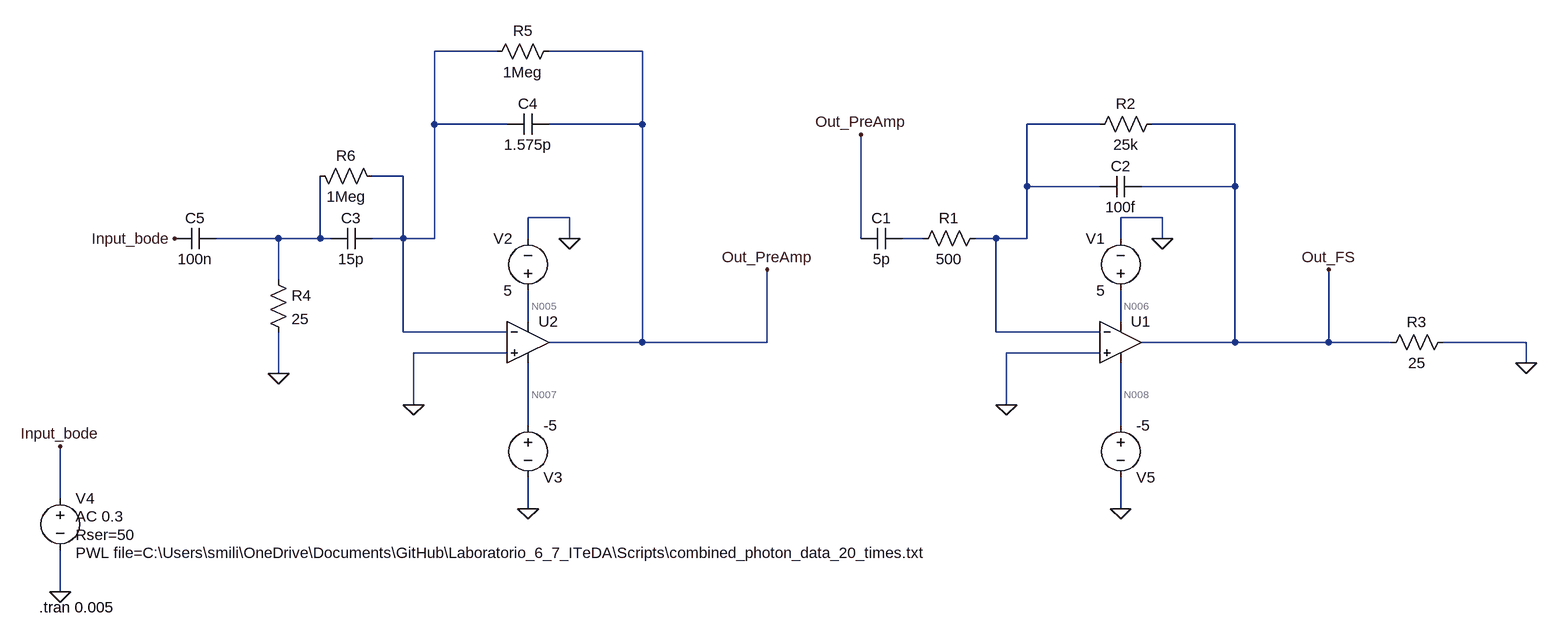
[diagram p0: schematic Test Hist Unos - Circuito con Cap Actualizado.asc]
Test Hist Unos - Circuito con Cap Actualizado.asc, the LTspice schematic file:
Version 4
SHEET 1 1364 680
WIRE -240 -224 -336 -224
WIRE -16 -224 -160 -224
WIRE -336 -112 -336 -224
WIRE -224 -112 -336 -112
WIRE -16 -112 -16 -224
WIRE -16 -112 -160 -112
WIRE 688 -112 576 -112
WIRE 896 -112 768 -112
WIRE -384 -32 -432 -32
WIRE 576 -16 576 -112
WIRE 688 -16 576 -16
WIRE 896 -16 896 -112
WIRE 896 -16 752 -16
WIRE -128 32 -192 32
WIRE 784 32 720 32
WIRE -576 64 -672 64
WIRE -512 64 -512 -32
WIRE -512 64 -576 64
WIRE -496 64 -512 64
WIRE -384 64 -384 -32
WIRE -384 64 -432 64
WIRE -336 64 -336 -112
WIRE -336 64 -384 64
WIRE -192 64 -192 32
WIRE -128 64 -128 32
WIRE 320 64 320 -96
WIRE 416 64 384 64
WIRE 528 64 496 64
WIRE 576 64 576 -16
WIRE 576 64 528 64
WIRE 720 64 720 32
WIRE 784 64 784 32
WIRE -576 128 -576 64
WIRE -192 192 -192 144
WIRE 720 192 720 144
WIRE -384 208 -384 64
WIRE -224 208 -384 208
WIRE 528 208 528 64
WIRE 688 208 528 208
WIRE -16 224 -16 -112
WIRE -16 224 -160 224
WIRE 176 224 176 112
WIRE 176 224 -16 224
WIRE 896 224 896 -16
WIRE 896 224 752 224
WIRE 1040 224 1040 112
WIRE 1040 224 896 224
WIRE 1136 224 1040 224
WIRE 1344 224 1216 224
WIRE -224 240 -368 240
WIRE 688 240 544 240
WIRE 1344 256 1344 224
WIRE -576 272 -576 208
WIRE -368 320 -368 240
WIRE 544 320 544 240
WIRE -192 352 -192 256
WIRE 720 352 720 256
WIRE -912 464 -912 384
WIRE -192 480 -192 432
WIRE 720 480 720 432
WIRE -912 608 -912 544
FLAG 784 64 0
FLAG 544 320 0
FLAG 1040 112 Out_FS
FLAG 1344 256 0
FLAG 320 -96 Out_PreAmp
FLAG -912 608 0
FLAG -912 384 Input_bode
FLAG -192 480 0
FLAG -128 64 0
FLAG -368 320 0
FLAG 176 112 Out_PreAmp
FLAG -736 64 Input_bode
FLAG -576 272 0
FLAG 720 480 0
SYMBOL res 512 48 R90
WINDOW 0 0 56 VBottom 2
WINDOW 3 32 56 VTop 2
SYMATTR InstName R1
SYMATTR Value 500
SYMBOL res 784 -128 R90
WINDOW 0 0 56 VBottom 2
WINDOW 3 32 56 VTop 2
SYMATTR InstName R2
SYMATTR Value 25k
SYMBOL voltage 720 160 R180
WINDOW 0 24 96 Left 2
WINDOW 3 24 16 Left 2
WINDOW 123 0 0 Left 0
WINDOW 39 0 0 Left 0
SYMATTR InstName V1
SYMATTR Value 5
SYMBOL OpAmps\\UniversalOpAmp1 720 224 R0
SYMATTR InstName U1
SYMATTR Value2 Avol=1900 GBW=897.0831Meg Vos=0
SYMBOL res 1232 208 R90
WINDOW 0 0 56 VBottom 2
WINDOW 3 32 56 VTop 2
SYMATTR InstName R3
SYMATTR Value 25
SYMBOL cap 384 48 R90
WINDOW 0 0 32 VBottom 2
WINDOW 3 32 32 VTop 2
SYMATTR InstName C1
SYMATTR Value 5p
SYMBOL cap 752 -32 R90
WINDOW 0 0 32 VBottom 2
WINDOW 3 32 32 VTop 2
SYMATTR InstName C2
SYMATTR Value 100f
SYMBOL voltage -192 160 R180
WINDOW 0 24 96 Left 2
WINDOW 3 24 16 Left 2
WINDOW 123 0 0 Left 0
WINDOW 39 0 0 Left 0
SYMATTR InstName V2
SYMATTR Value 5
SYMBOL voltage -192 336 R0
WINDOW 0 24 96 Left 2
WINDOW 3 24 16 Left 2
WINDOW 123 0 0 Left 0
WINDOW 39 0 0 Left 0
SYMATTR InstName V3
SYMATTR Value -5
SYMBOL OpAmps\\UniversalOpAmp1 -192 224 R0
SYMATTR InstName U2
SYMATTR Value2 Avol=1900 GBW=897.0831Meg Vos=0
SYMBOL voltage -912 448 R0
WINDOW 123 24 44 Left 2
WINDOW 39 24 72 Left 2
WINDOW 3 24 100 Left 2
SYMATTR Value2 AC 0.3
SYMATTR SpiceLine Rser=50
SYMATTR Value PWL file=C:\Users\smili\OneDrive\Documents\GitHub\Laboratorio_6_7_ITeDA\Scripts\combined_photon_data_20_times.txt
SYMATTR InstName V4
SYMBOL cap -432 48 R90
WINDOW 0 0 32 VBottom 2
WINDOW 3 32 32 VTop 2
SYMATTR InstName C3
SYMATTR Value 15p
SYMBOL cap -160 -128 R90
WINDOW 0 0 32 VBottom 2
WINDOW 3 32 32 VTop 2
SYMATTR InstName C4
SYMATTR Value 1.575p
SYMBOL res -592 112 R0
SYMATTR InstName R4
SYMATTR Value 25
SYMBOL res -144 -240 R90
WINDOW 0 0 56 VBottom 2
WINDOW 3 32 56 VTop 2
SYMATTR InstName R5
SYMATTR Value 1Meg
SYMBOL res -528 -48 M90
WINDOW 0 0 56 VBottom 2
WINDOW 3 32 56 VTop 2
SYMATTR InstName R6
SYMATTR Value 1Meg
SYMBOL cap -672 48 R90
WINDOW 0 0 32 VBottom 2
WINDOW 3 32 32 VTop 2
SYMATTR InstName C5
SYMATTR Value 100n
SYMBOL voltage 720 336 R0
WINDOW 0 24 96 Left 2
WINDOW 3 24 16 Left 2
WINDOW 123 0 0 Left 0
WINDOW 39 0 0 Left 0
SYMATTR InstName V5
SYMATTR Value -5
TEXT -944 632 Left 2 !.tran 0.005

The netlist it stands for:
* Test Hist Unos - Circuito con Cap Actualizado.asc
R1 N002 N004 500
R2 Out_FS N002 25k
V1 N006 0 5
XU1 0 N002 N006 N008 Out_FS level1 Avol=1900 GBW=897.0831Meg Vos=0 En=0 Enk=0 In=0 Ink=0 Rin=500Meg  ; pins In+ In- V+ V- OUT
R3 0 Out_FS 25
C1 N004 Out_PreAmp 5p
C2 Out_FS N002 100f
V2 N005 0 5
V3 N007 0 -5
XU2 0 N001 N005 N007 Out_PreAmp level1 Avol=1900 GBW=897.0831Meg Vos=0 En=0 Enk=0 In=0 Ink=0 Rin=500Meg  ; pins In+ In- V+ V- OUT
V4 Input_bode 0 PWL file=C:\Users\smili\OneDrive\Documents\GitHub\Laboratorio_6_7_ITeDA\Scripts\combined_photon_data_20_times.txt AC 0.3 Rser=50
C3 N001 N003 15p
C4 Out_PreAmp N001 1.575p
R4 N003 0 25
R5 Out_PreAmp N001 1Meg
R6 N003 N001 1Meg
C5 N003 Input_bode 100n
V5 N008 0 -5
.tran 0.005
.lib UniversalOpAmp1.lib
.backanno
.end

* Results of the author's LTspice run, read from the files saved beside the schematic
* Operating Point, zero values left out:
*   V(n006) = 5 V
*   V(n008) = -5 V
*   V(n005) = 5 V
*   V(n007) = -5 V
*   I(V1) = -10 nA
*   I(V2) = -10 nA
*   I(V3) = 10 nA
*   I(V5) = 10 nA
*   Ix(u1:3) = 10 nA
*   Ix(u1:4) = -10 nA
*   Ix(u2:3) = 10 nA
*   Ix(u2:4) = -10 nA